# Altium project PCB_Project1.PrjPCB
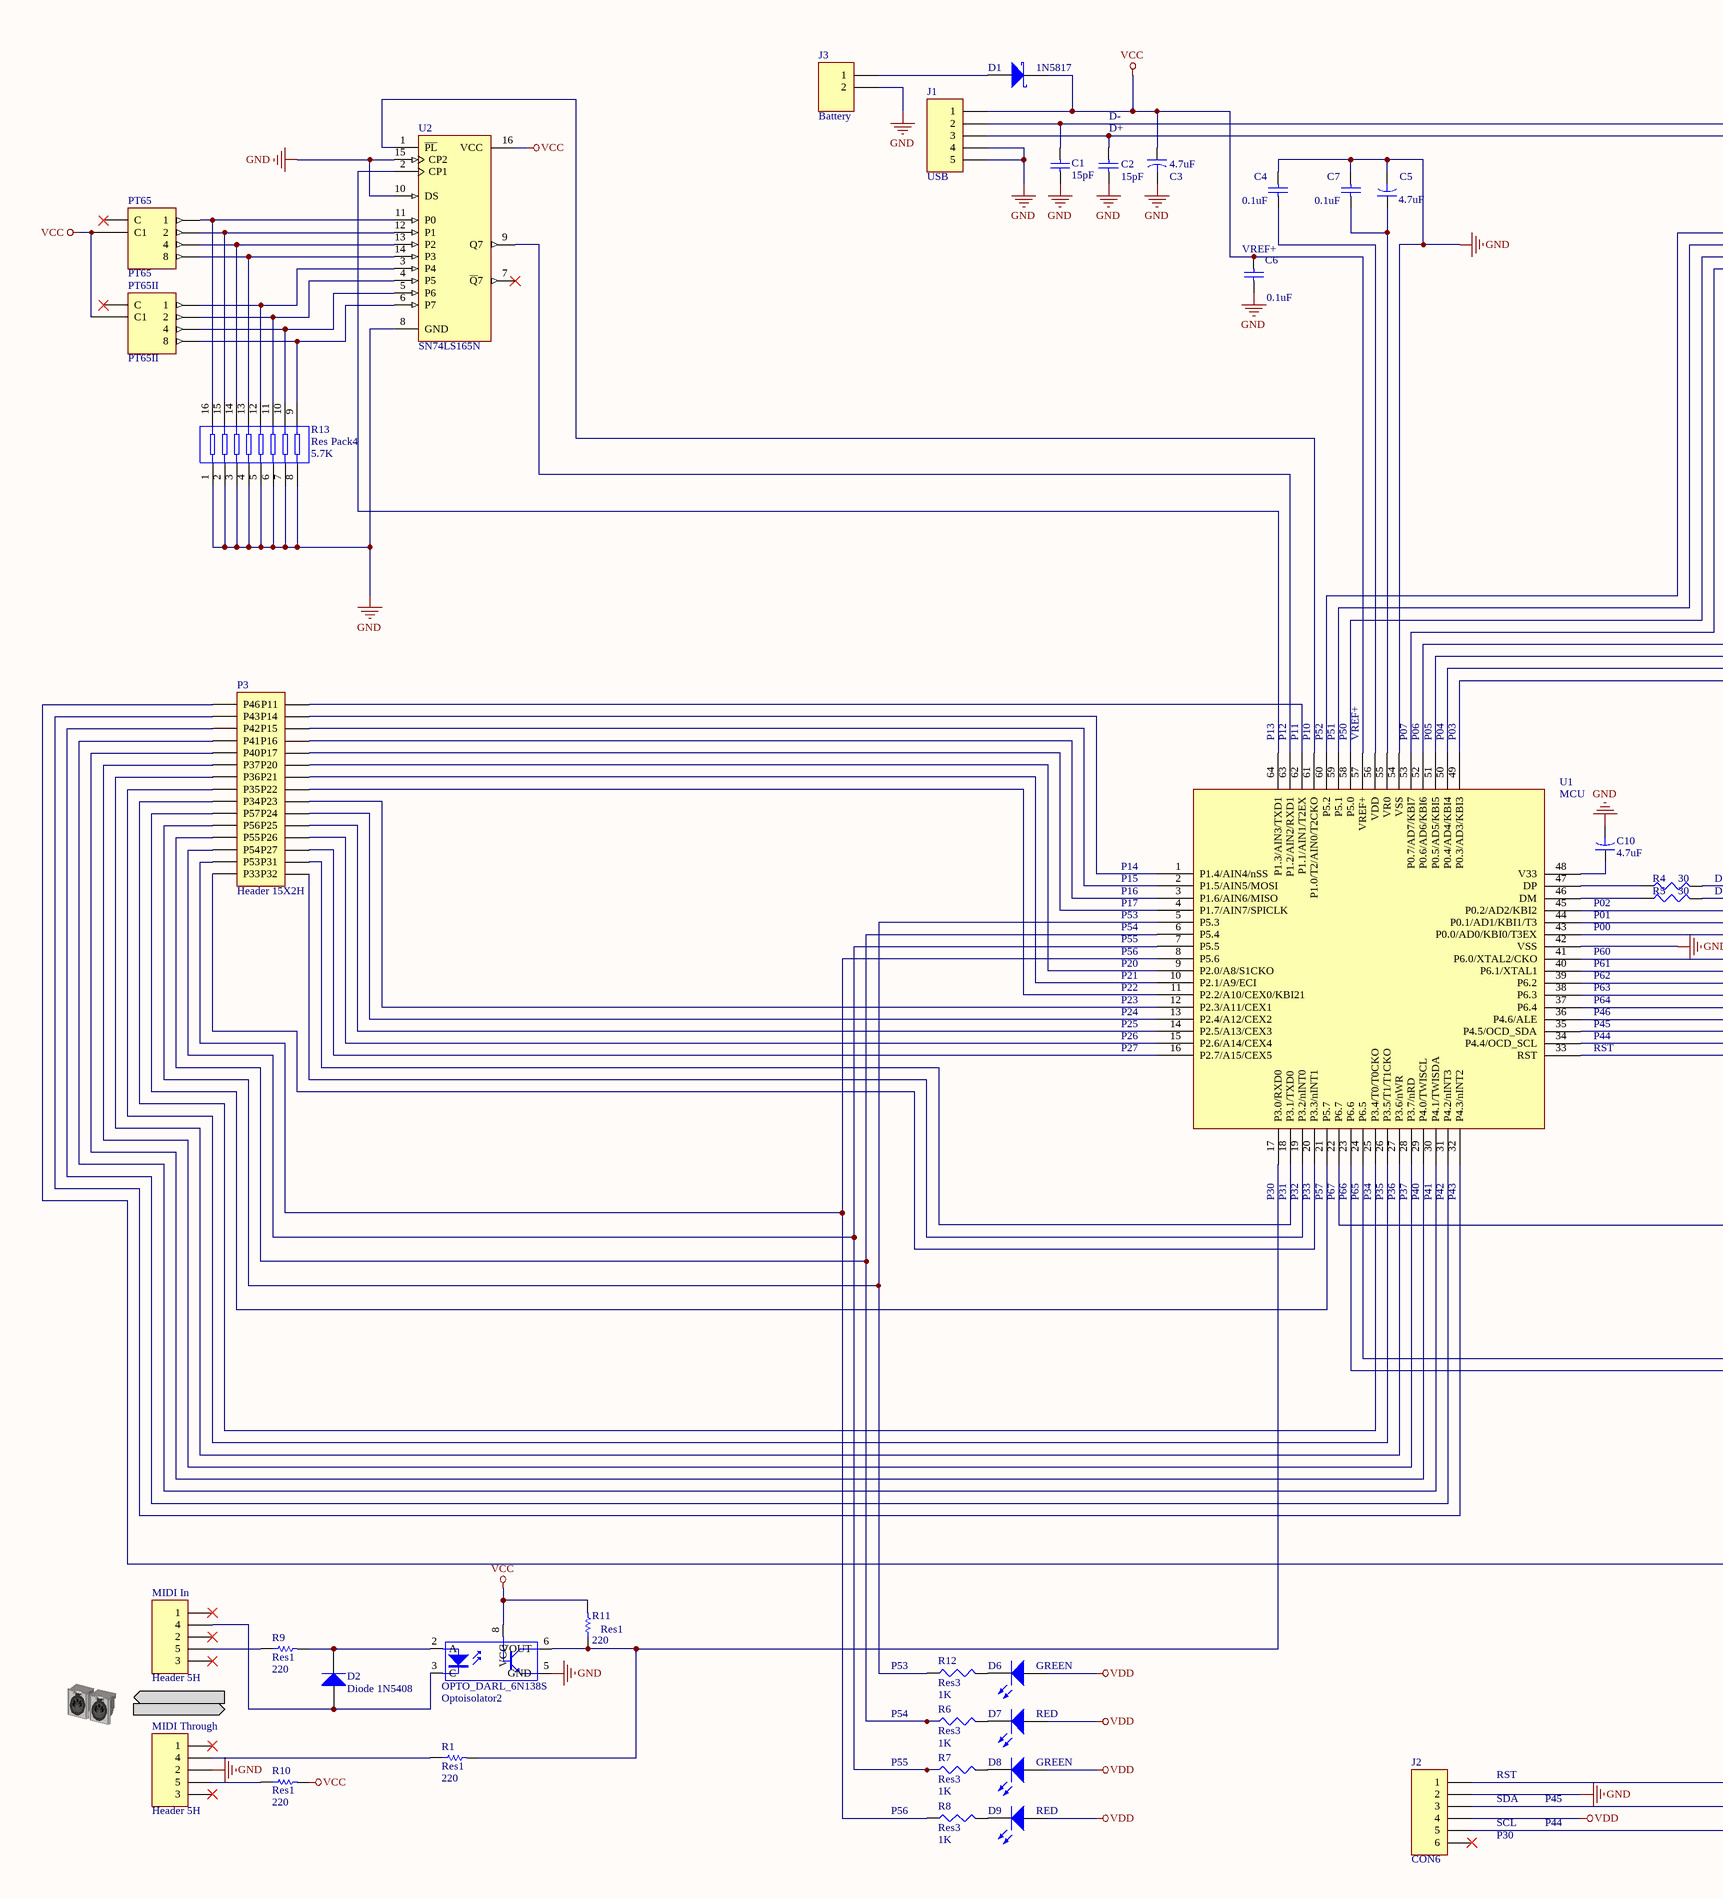
[diagram p0: Sheet2.SchDoc, left]
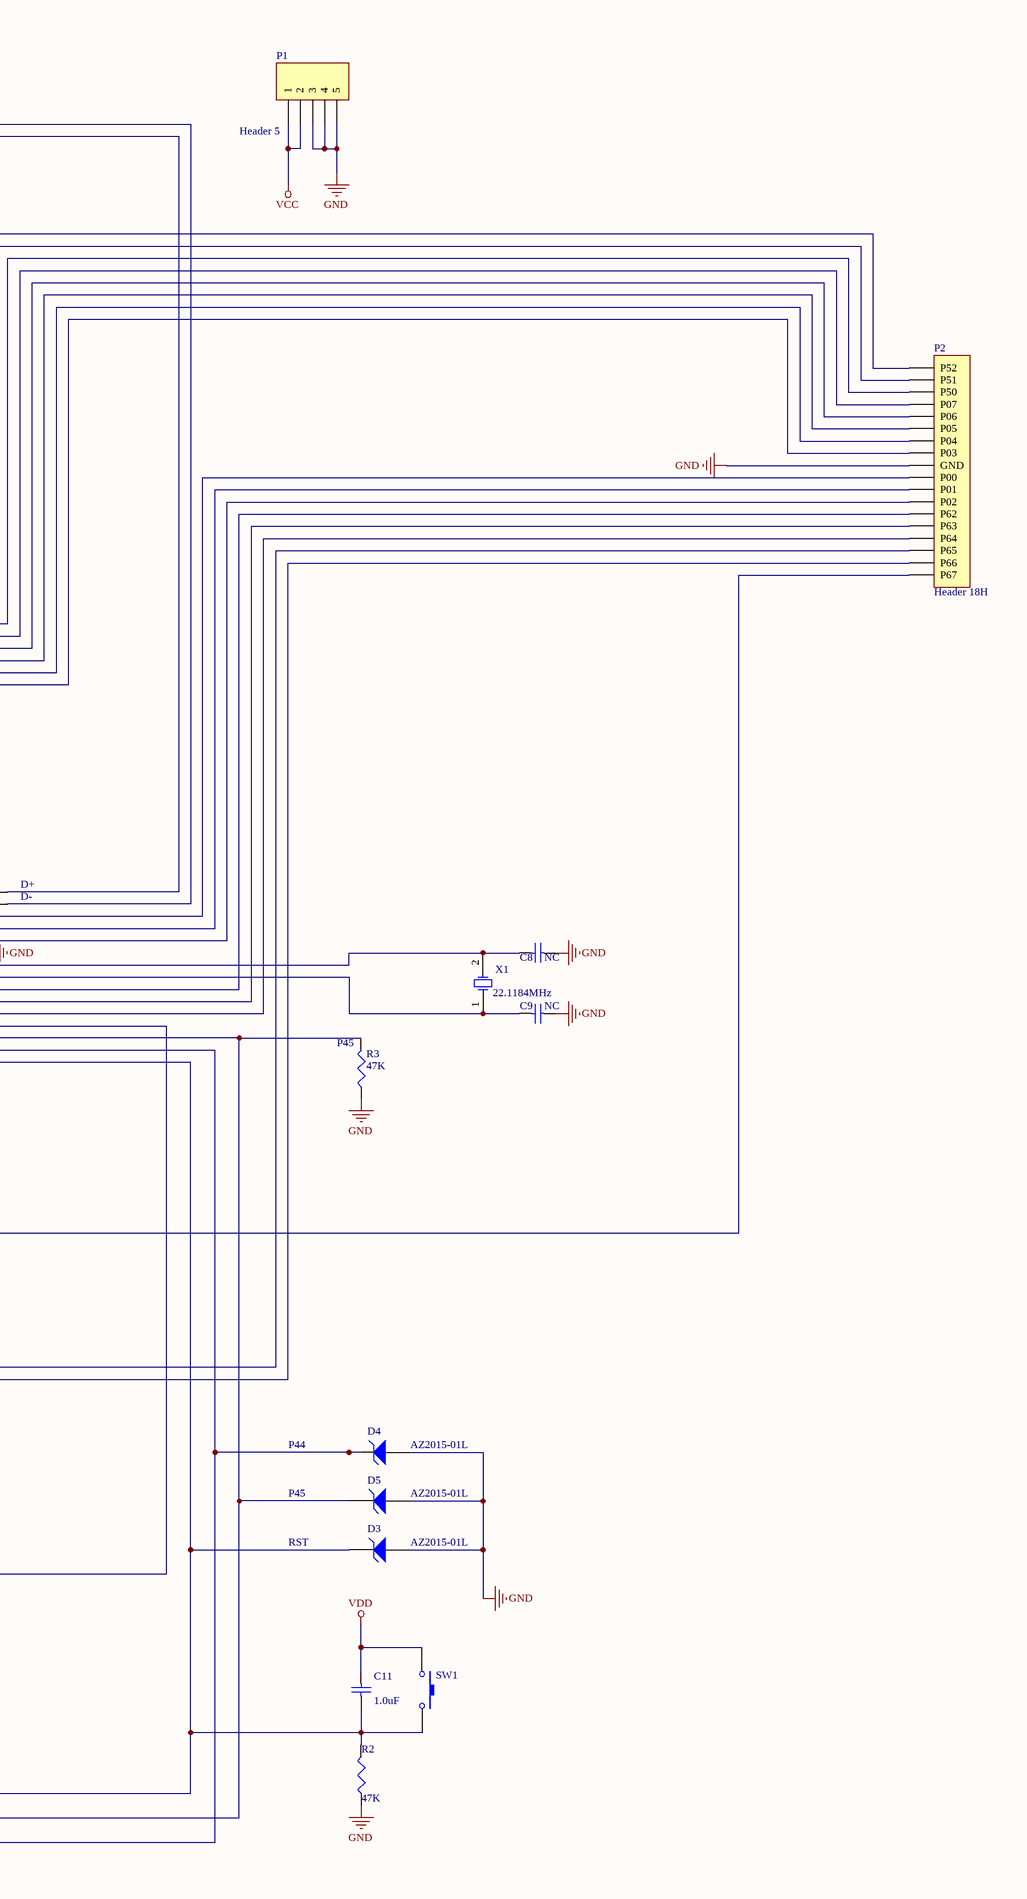
[diagram p1: Sheet2.SchDoc, right]
1 sheet, 49 parts. Net scope: global (net labels, ports and power ports of the same name join across sheets).
Board file: PCB1.PcbDoc

## Sheet Sheet2.SchDoc
size A2; PageSetup: Record=PageOptions?CenterHorizontal=True?CenterVertical=True?PrintScale=1.00?XCorrection=1.00?YCorrection=1.00?PrintKind=1?BorderSize=5000000?LeftOffset=0?BottomOffset=0?Orientation=2?PaperLength=1000?PaperWidth=1000?Scale=100?PaperSource=7?PrintQuality=-4?MediaType=1?DitherType=10?PaperKind=A4?PrintScaleMode=1

### Parts
?  MIDI  (value not drawn)
C1  value 15pF  [C1206]
C2  value 15pF  [C1206]
C3  value 4.7uF  [CAPR5-4X5]
C4  0.1uF  [C1206]
C5  4.7uF  [CAPR5-4X5]
C6  0.1uF  [RAD-0.3]
C7  0.1uF  [C1206]
C8  value NC  [C1206]
C9  value NC  [C1206]
C10  4.7uF  [CAPR5-4X5]
C11  value 1.0uF  [C1206]
D1  1N5817  [TO-220AC]
D2  Diode 1N5408  [DO-201AD]
D3  AZ2015-01L  [DIODE-0.7]
D4  AZ2015-01L  [DIODE-0.7]
D5  AZ2015-01L  [DIODE-0.7]
D6  GREEN  [LED-1]
D7  RED  [LED-1]
D8  GREEN  [LED-1]
D9  RED  [LED-1]
J1  (no value)  [HDR1X5]
J2  CON6  [HDR1X6]
J3  Battery  [HDR1X3]
MIDI_In  Header 5H  [HDR1X5H]
MIDI_Through  Header 5H  [HDR1X5H]
OPTO_DARL_6N138S  Optoisolator2  [SOP5(6)]
P1  Header 5  [HDR1X5]
P2  Header 18H  [HDR1X18H]
P3  Header 15X2H  [HDR2X15H]
PT65  PT65  [HDR2X4]
PT65II  PT65II  [HDR2X4]
R1  Res1  value 220  [AXIAL-0.3]
R2  value 47K  [J1-0603]
R3  value 47K  [J1-0603]
R4  30  [J1-0603]
R5  30  [J1-0603]
R6  Res3  value 1K  [J1-0603]
R7  Res3  value 1K  [J1-0603]
R8  Res3  value 1K  [J1-0603]
R9  Res1  value 220  [AXIAL-0.3]
R10  Res1  value 220  [AXIAL-0.3]
R11  Res1  value 220  [AXIAL-0.3]
R12  Res3  value 1K  [J1-0603]
R13  Res Pack4  value 5.7K  [SSOP16_N]
SW1  (no value)  [SPST-2]
U1  MCU  [MG84FG516]
U2  SN74LS165N  [648-08]
X1  22.1184MHz  [R38]

### Nets
GND: C1.1 C2.1 C3.2 C4.2 C5.2 C6.1 C7.2 C8.1 C9.1 C10.2 D3.1(A) D4.1(A) D5.1(A) J1.4 J1.5 J2.2 J3.2 MIDI_Through.2 OPTO_DARL_6N138S.5(GND) P1.3 P1.4 P1.5 P2.9(GND) R2.1 R3.1 R13.1 R13.2 R13.3 R13.4 R13.5 R13.6 R13.7 R13.8 U1.42(VSS) U1.54(VSS) U2.8(GND) U2.10(DS) U2.15(CP2)
VCC: C3.1 C6.2 D1.1(K) J1.1 OPTO_DARL_6N138S.8(VCC) P1.1 P1.2 PT65.C1 PT65II.C1 R10.2 R11.2 U1.57(VREF+) U2.16(VCC)
VDD: C11.1 D6.1(A) D7.1(A) D8.1(A) D9.1(A) J2.4 SW1.1
NetC1_2: C1.2 J1.2 R5.2
NetC2_2: C2.2 J1.3 R4.2
NetC4_1: C4.1 U1.56(VDD)
NetC5_1: C5.1 C7.1 U1.55(VR0)
NetC8_2: C8.2 U1.41(P6.0/XTAL2/CKO) X1.2(OSC2)
NetC9_2: C9.2 U1.40(P6.1/XTAL1) X1.1(OSC1)
NetC10_1: C10.1 U1.48(V33)
NetC11_2: C11.2 D3.2(K) J2.1 R2.2 SW1.2 U1.33(RST)
NetD1_3: D1.3(A) J3.1
NetD2_1: D2.1(A) MIDI_In.4 OPTO_DARL_6N138S.3(C)
NetD2_2: D2.2(K) OPTO_DARL_6N138S.2(A) R9.2
NetD4_2: D4.2(K) J2.5 U1.34(P4.4/OCD_SCL)
NetD5_2: D5.2(K) J2.3 R3.2 U1.35(P4.5/OCD_SDA)
NetD6_2: D6.2(K) R12.2
NetD7_2: D7.2(K) R6.2
NetD8_2: D8.2(K) R7.2
NetD9_2: D9.2(K) R8.2
NetMIDI_In_5: MIDI_In.5 R9.1
NetMIDI_Through_4: MIDI_Through.4 R1.1
NetMIDI_Through_5: MIDI_Through.5 R10.1
NetOPTO_DARL_6N138S_6: OPTO_DARL_6N138S.6(VOUT) R1.2 R11.1 U1.17(P3.0/RXD0)
NetP2_1: P2.1(P52) U1.60(P5.2)
NetP2_2: P2.2(P51) U1.59(P5.1)
NetP2_3: P2.3(P50) U1.58(P5.0)
NetP2_4: P2.4(P07) U1.53(P0.7/AD7/KBI7)
NetP2_5: P2.5(P06) U1.52(P0.6/AD6/KBI6)
NetP2_6: P2.6(P05) U1.51(P0.5/AD5/KBI5)
NetP2_7: P2.7(P04) U1.50(P0.4/AD4/KBI4)
NetP2_8: P2.8(P03) U1.49(P0.3/AD3/KBI3)
NetP2_10: P2.10(P00) U1.45(P0.2/AD2/KBI2)
NetP2_11: P2.11(P01) U1.44(P0.1/AD1/KBI1/T3)
NetP2_12: P2.12(P02) U1.43(P0.0/AD0/KBI0/T3EX)
NetP2_13: P2.13(P62) U1.39(P6.2)
NetP2_14: P2.14(P63) U1.38(P6.3)
NetP2_15: P2.15(P64) U1.37(P6.4)
NetP2_16: P2.16(P65) U1.24(P6.5)
NetP2_17: P2.17(P66) U1.23(P6.6)
NetP2_18: P2.18(P67) U1.22(P6.7)
NetP3_1: P3.1(P46) U1.36(P4.6/ALE)
NetP3_2: P3.2(P11) U1.62(P1.1/AIN1/T2EX)
NetP3_3: P3.3(P43) U1.32(P4.3/nINT2)
NetP3_4: P3.4(P14) U1.1(P1.4/AIN4/nSS)
NetP3_5: P3.5(P42) U1.31(P4.2/nINT3)
NetP3_6: P3.6(P15) U1.2(P1.5/AIN5/MOSI)
NetP3_7: P3.7(P41) U1.30(P4.1/TWISDA)
NetP3_8: P3.8(P16) U1.3(P1.6/AIN6/MISO)
NetP3_9: P3.9(P40) U1.29(P4.0/TWISCL)
NetP3_10: P3.10(P17) U1.4(P1.7/AIN7/SPICLK)
NetP3_11: P3.11(P37) U1.28(P3.7/nRD)
NetP3_12: P3.12(P20) U1.9(P2.0/A8/S1CKO)
NetP3_13: P3.13(P36) U1.27(P3.6/nWR)
NetP3_14: P3.14(P21) U1.10(P2.1/A9/ECI)
NetP3_15: P3.15(P35) U1.26(P3.5/T1/T1CKO)
NetP3_16: P3.16(P22) U1.11(P2.2/A10/CEX0/KBI21)
NetP3_17: P3.17(P34) U1.25(P3.4/T0/T0CKO)
NetP3_18: P3.18(P23) U1.12(P2.3/A11/CEX1)
NetP3_19: P3.19(P57) U1.21(P5.7)
NetP3_20: P3.20(P24) U1.13(P2.4/A12/CEX2)
NetP3_21: P3.21(P56) R12.1 U1.5(P5.3)
NetP3_22: P3.22(P25) U1.14(P2.5/A13/CEX3)
NetP3_23: P3.23(P55) R6.1 U1.6(P5.4)
NetP3_24: P3.24(P26) U1.15(P2.6/A14/CEX4)
NetP3_25: P3.25(P54) R7.1 U1.7(P5.5)
NetP3_26: P3.26(P27) U1.16(P2.7/A15/CEX5)
NetP3_27: P3.27(P53) R8.1 U1.8(P5.6)
NetP3_28: P3.28(P31) U1.18(P3.1/TXD0)
NetP3_29: P3.29(P33) U1.20(P3.3/nINT1)
NetP3_30: P3.30(P32) U1.19(P3.2/nINT0)
NetPT65_1: PT65.1 R13.16 U2.11(P0)
NetPT65_2: PT65.2 R13.15 U2.12(P1)
NetPT65_4: PT65.4 R13.14 U2.13(P2)
NetPT65_8: PT65.8 R13.13 U2.14(P3)
NetPT65II_1: PT65II.1 R13.12 U2.3(P4)
NetPT65II_2: PT65II.2 R13.11 U2.4(P5)
NetPT65II_4: PT65II.4 R13.10 U2.5(P6)
NetPT65II_8: PT65II.8 R13.9 U2.6(P7)
NetR4_1: R4.1 U1.47(DP)
NetR5_1: R5.1 U1.46(DM)
NetU1_61: U1.61(P1.0/T2/AIN0/T2CKO) U2.1(~{PL})
NetU1_63: U1.63(P1.2/AIN2/RXD1) U2.9(Q7)
NetU1_64: U1.64(P1.3/AIN3/TXD1) U2.2(CP1)

Not connected (* = marked no-connect by the designer): J2 6*; MIDI_In 1* 2* 3*; MIDI_Through 1* 3*; PT65 C*; PT65II C*; U2 7(~{Q}7)*

### Notes on the sheet
- D-
- (near C2) D+
- (near C6) VREF+
- P13
- P12
- P11
- P10
- P52
- P51
- P50
- VREF+
- P07
- P06
- P05
- P04
- P03
- P14
- P15
- P16
- P17
- P02
- D+
- P53
- P54
- P55
- P56
- P20
- P01
- P00
- P60
- P61
- P21
- P22
- P23
- P24
- P25
- P62
- P63
- P64
- P46
- P45
- P26
- P27
- P44
- RST
- (near R3) P45
- P30
- P31
- P32
- P33
- P57
- P67
- P66
- P65
- P34
- P35
- P36
- P37
- P40
- P41
- P42
- P43
- (near R12) P53
- SDA
- SCL
- Labels drawn without touching a wire or pin: VCC
- (in symbol Header 5) USB

### Library data of the parts
? = MIDI: MIDI Connector; PortComponent: True; Published: 16-Mar-2009; Publisher: Altium Limited; HelpURL: https://wiki.altium.com/display/ADOH/NanoBoard+3000+-+MIDI+Interface
C1 C2 C4 C7-C9 C11 = Cap Semi: Capacitor (Semiconductor SIM Model); Published: 8-Jun-2000; LatestRevisionDate: 29-May-2009; LatestRevisionNote: IPC-7351 Footprint Added.; PackageReference: C1206; Publisher: Altium Limited; PackageDescription: Chip Capacitor
C3 C5 C10 = Cap2: Capacitor; Published: 23-Sep-2002; PackageReference: CAPR5-4X5; Publisher: Altium Limited; PackageDescription: Capacitor; 2 Leads
C6 = Cap: Capacitor; Published: 8-Jun-2000; LatestRevisionDate: 17-Jul-2002; LatestRevisionNote: Re-released for DXP Platform.; PackageReference: RAD-0.3; Publisher: Altium Limited; PackageDescription: Radial Cap, Thru-Hole; 2 Leads; 0.3 in Pin Spacing
D1 = Diode 10TQ040: Schottky Rectifier; Note: Terminal 2 is the TAB and is electrically connected to the cathode; Published: 8-Jun-2000; LatestRevisionDate: 17-Jul-2002; LatestRevisionNote: Re-released for DXP Platform.; DatasheetVersion: PD-2.057B; PackageVersion: Feb-1998; PackageReference: TO-220AC; Publisher: Altium Limited; PackageDescription: TO, Thru-Hole, Vertical, Heatsink Mounted; 3 In-Line Leads (1 Absent); Pitch 2.54 mm; ComponentLink1Description: Manufacturer Link; ComponentLink1URL: http://www.irf.com/
D2 = Diode 1N5408: 3 Amp Medium Power Silicon Rectifier Diode; Published: 8-Jun-2000; LatestRevisionDate: 17-Jul-2002; LatestRevisionNote: Re-released for DXP Platform.; DatasheetVersion: Aug-1984; PackageReference: DO-201AD; Publisher: Altium Limited; PackageDescription: Diode, Axial; Body 9.5 x 5.3 mm (LxDia. max), Lead Dia. 1.32 mm (max); ComponentLink1Description: Manufacturer Link; ComponentLink1URL: http://www.irf.com/
D3-D5 = D Zener: Zener Diode; Published: 8-Jun-2000; LatestRevisionDate: 17-Jul-2002; LatestRevisionNote: Re-released for DXP Platform.; PackageReference: DIODE-0.7; Publisher: Altium Limited; PackageDescription: Diode, Thru-Hole; 2 Leads; 0.7 in Pin Spacing
D6-D9 = LED1: Typical RED GaAs LED; Published: 8-Jun-2000; LatestRevisionDate: 08-Jul-2005; LatestRevisionNote: Mech Layer 1 removed.; PackageReference: LED-1; Publisher: Altium Limited; PackageDescription: LED; 2 Leads
J1 P1 = Header 5: Header, 5-Pin; LatestRevisionDate: 17-Jul-2002; LatestRevisionNote: Re-released for DXP Platform.; Publisher: Altium Limited
J2 = Header 6: Header, 6-Pin; LatestRevisionDate: 17-Jul-2002; LatestRevisionNote: Re-released for DXP Platform.; Publisher: Altium Limited
J3 = Header 3: Header, 3-Pin; LatestRevisionDate: 17-Jul-2002; LatestRevisionNote: Re-released for DXP Platform.; Publisher: Altium Limited
MIDI_In MIDI_Through = Header 5H: Header, 5-Pin, Right Angle; LatestRevisionDate: 17-Jul-2002; LatestRevisionNote: Re-released for DXP Platform.; Publisher: Altium Limited
OPTO_DARL_6N138S = Optoisolator2: 5 Pin Mini Flat Pack Optocoupler; Published: 24-Mar-1999; LatestRevisionDate: 04-Mar-2005; LatestRevisionNote: PCB Footprint replaced, Sch pins re-numbered.; DatasheetVersion: Apr-2004; PackageReference: SOP5(6); Publisher: Altium Limited; PackageDescription: Small Outline; 6 Leads (1 Absent); Body Width 4.4 mm; Pitch 1.27 mm
P2 = Header 18H: Header, 18-Pin, Right Angle; LatestRevisionDate: 17-Jul-2002; LatestRevisionNote: Re-released for DXP Platform.; Publisher: Altium Limited
P3 = Header 15X2H: Header, 15-Pin, Dual row, Right Angle; LatestRevisionDate: 17-Jul-2002; LatestRevisionNote: Re-released for DXP Platform.; Publisher: Altium Limited
PT65 PT65II = Header 4X2: Header, 4-Pin, Dual row; LatestRevisionDate: 17-Jul-2002; LatestRevisionNote: Re-released for DXP Platform.; Publisher: Altium Limited
R1 R9-R11 = Res1: Resistor; Published: 8-Jun-2000; LatestRevisionDate: 17-Jul-2002; LatestRevisionNote: Re-released for DXP Platform.; PackageReference: AXIAL-0.3; Publisher: Altium Limited; PackageDescription: Axial Device, Thru-Hole; 2 Leads; 0.3 in Pin Spacing
R2-R8 R12 = Res3: Resistor; Published: 8-Jun-2000; LatestRevisionDate: 29-May-2009; LatestRevisionNote: IPC-7351 Footprint Added.; PackageReference: J1-0603; Publisher: Altium Limited; PackageDescription: Chip Resistor
R13 = Res Pack4: Isolated Resistor Network; Published: 24-Mar-1999; LatestRevisionDate: 29-May-2009; LatestRevisionNote: IPC-7351 Footprint Added.; PackageVersion: Oct-2003; PackageReference: SSOP16; Publisher: Altium Limited; PackageDescription: 16-Pin Plastic Small Outline Package 0.65 mm Pitch; Code_JEDEC: MO-150-AC; Code_IPC: SOP65P780-16
SW1 = SW-PB: Switch; Published: 24-Mar-1999; LatestRevisionDate: 17-Jul-2002; LatestRevisionNote: Re-released for DXP Platform.; PackageReference: SPST-2; Publisher: Altium Limited; PackageDescription: Switch; 2 Leads
U1 = Component_1
U2 = SN74LS165N: 8-Bit Parallel-to-Serial Shift Register; ComponentAvailability: Not for New Design; Published: 15-Apr-2002; DatasheetVersion: Dec-1999; PackageVersion: Apr-2000; PackageReference: 648-08; Publisher: Altium Limited; PackageDescription: DIP; 16 Leads; Row Spacing 7.62 mm; Pitch 2.54 mm; Code_JEDEC: MS-001-BB; ComponentLink1Description: Manufacturer Link; ComponentLink1URL: http://www.onsemi.com/; ComponentLink2Description: Datasheet; ComponentLink2URL: http://www.onsemi.com/pub/Collateral/SN74LS165-D.PDF
X1 = XTAL: Crystal Oscillator; Published: 8-Jun-2000; LatestRevisionDate: 17-Jul-2002; LatestRevisionNote: Re-released for DXP Platform.; PackageReference: R38; Publisher: Altium Limited; PackageDescription: Crystal, Thru-Hole; 2 Leads; Body 3.1 x 8.2 mm (Dia.xH); MHz: 22.1184MHz